# EAGLE design FlashPak (EAGLE 7.7.0)
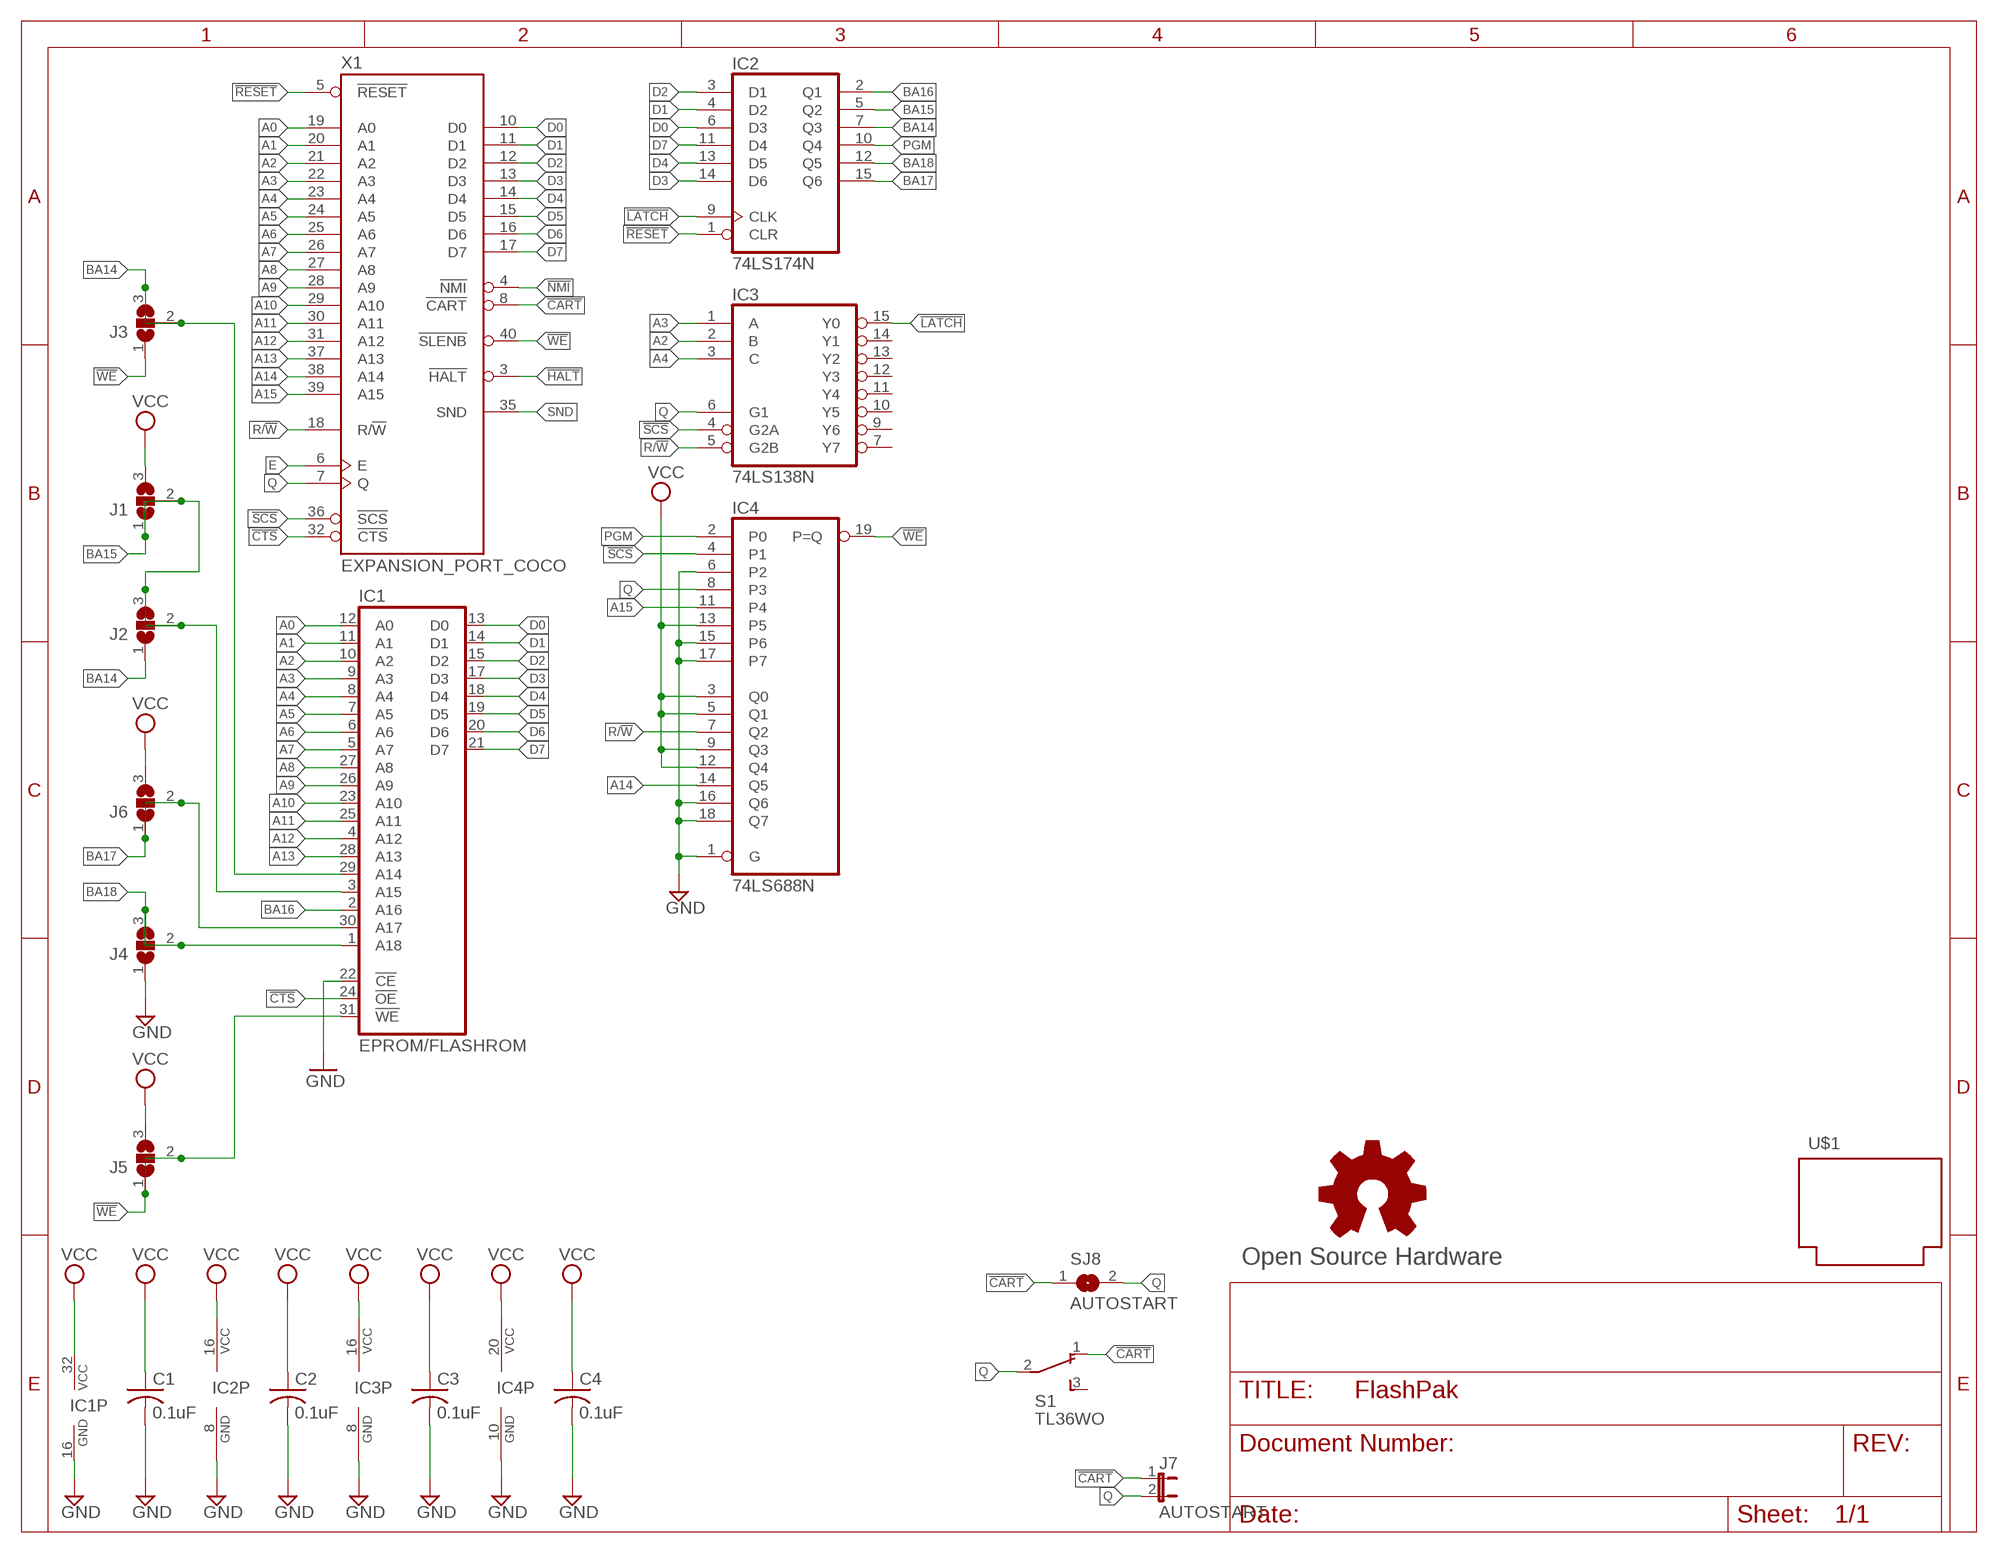
[diagram p0: schematic, sheet 1]

## Parts
C1  0.1uF  C-US025-025X050  [C025-025X050]
C2  0.1uF  C-US025-025X050  [C025-025X050]
C3  0.1uF  C-US025-025X050  [C025-025X050]
C4  0.1uF  C-US025-025X050  [C025-025X050]
GOLD_ORB_SM1  Open Source Hardware  OSHWLOGOLOGO8MM  [OSHW_8MM]
IC1  EPROM/FLASHROM  SST39SF040APHR  [DIL32-RP]
IC2  74LS174N  [DIL16-RP]
IC3  74LS138N  [DIL16-RP]
IC4  74LS688N  [DIL20-RP]
J1  SJ2W  [SJ_2]
J2  SJ2W  [SJ_2]
J3  SJ2W  [SJ_2]
J4  SJ2W  [SJ_2]
J5  SJ2W  [SJ_2]
J6  SJ2W  [SJ_2]
J7  AUTOSTART  JP1E  [JP1]
S1  TL36WO  [TL3XWO]
SJ8  AUTOSTART  SJ  [SJ]
U$1  PROGRAM_PAK  [PROGRAM_PAK]
X1  EXPANSION_PORT_COCO  [MA20-2]

## Nets
!CART: J7.1 S1.1(O) SJ8.1 X1.8(!CART)
!CTS: IC1.24(!OE) X1.32(!CTS)
!HALT: X1.3(!HALT)
!LATCH: IC2.9(CLK) IC3.15(Y0)
!NMI: X1.4(!NMI)
!RESET: IC2.1(CLR) X1.5(!RESET)
!SCS: IC3.4(G2A) IC4.4(P1) X1.36(!SCS)
!WE: IC1.31(!WE) IC4.19(P=Q) J3.1 J5.1 J5.2 X1.40(!SLENB)
A0: IC1.12(A0) X1.19(A0)
A1: IC1.11(A1) X1.20(A1)
A2: IC1.10(A2) IC3.2(B) X1.21(A2)
A3: IC1.9(A3) IC3.1(A) X1.22(A3)
A4: IC1.8(A4) IC3.3(C) X1.23(A4)
A5: IC1.7(A5) X1.24(A5)
A6: IC1.6(A6) X1.25(A6)
A7: IC1.5(A7) X1.26(A7)
A8: IC1.27(A8) X1.27(A8)
A9: IC1.26(A9) X1.28(A9)
A10: IC1.23(A10) X1.29(A10)
A11: IC1.25(A11) X1.30(A11)
A12: IC1.4(A12) X1.31(A12)
A13: IC1.28(A13) X1.37(A13)
A14: IC4.14(Q5) X1.38(A14)
A15: IC4.11(P4) X1.39(A15)
BA14: IC1.29(A14) IC2.7(Q3) J2.1 J3.2 J3.3
BA15: IC1.3(A15) IC2.5(Q2) J1.1 J1.2 J2.2 J2.3
BA16: IC1.2(A16) IC2.2(Q1)
BA17: IC1.30(A17) IC2.15(Q6) J6.1 J6.2
BA18: IC1.1(A18) IC2.12(Q5) J4.2 J4.3
D0: IC1.13(D0) IC2.6(D3) X1.10(D0)
D1: IC1.14(D1) IC2.4(D2) X1.11(D1)
D2: IC1.15(D2) IC2.3(D1) X1.12(D2)
D3: IC1.17(D3) IC2.14(D6) X1.13(D3)
D4: IC1.18(D4) IC2.13(D5) X1.14(D4)
D5: IC1.19(D5) X1.15(D5)
D6: IC1.20(D6) X1.16(D6)
D7: IC1.21(D7) IC2.11(D4) X1.17(D7)
E: X1.6(E)
GND: C1.2 C2.2 C3.2 C4.2 IC1.16(GND) IC1.22(!CE) IC2.8(GND) IC3.8(GND) IC4.1(G) IC4.6(P2) IC4.10(GND) IC4.15(P6) IC4.16(Q6) IC4.17(P7) IC4.18(Q7) J4.1
PGM: IC2.10(Q4) IC4.2(P0)
Q: IC3.6(G1) IC4.8(P3) J7.2 S1.2(P) SJ8.2 X1.7(Q)
R/!W: IC3.5(G2B) IC4.7(Q2) X1.18(R/!W)
SND: X1.35(SND)
VCC: C1.1 C2.1 C3.1 C4.1 IC1.32(VCC) IC2.16(VCC) IC3.16(VCC) IC4.3(Q0) IC4.5(Q1) IC4.9(Q3) IC4.12(Q4) IC4.13(P5) IC4.20(VCC) J1.3 J5.3 J6.3
Unconnected: IC3.7(Y7) IC3.9(Y6) IC3.10(Y5) IC3.11(Y4) IC3.12(Y3) IC3.13(Y2) IC3.14(Y1) S1.3(S)

## Power pins joined to a net without a drawn wire
+12V: X1.2(+12V)
-12V: X1.1(-12V)
GND: X1.33(GND) X1.34(GND)
VCC: X1.9(VCC)

## Library data of the parts
C1-C4 = rcl:C-US: CAPACITOR, American symbol
GOLD_ORB_SM1 = oshw:OSHWLOGO: The OSHW logo for PCB layout
IC1 = memory-sst:SST39SF040A: 4 Mbit x8 Multi-Purpose Flash Source: http://www.sst.com/dotAsset/40782.pdf
IC2 = 74xx-us-jlb:74*174: Hex D type FLIP FLOP, clear
IC3 = 74xx-us-jlb:74*138: 3-line to 8-line DECODER/DEMULTIPLEXER
IC4 = 74xx-us-jlb:74*688: 8-bit MAGNITUDE/IDENTITY COMPARATOR, totem pole
J1-J6 = jumper:SJ2W: SMD solder JUMPER
J7 = jumper:JP1E: JUMPER
S1 = switch:TL36WO: TINY SWITCH ON - ON Source: http://www2.produktinfo.conrad.com/datenblaetter/700000-724999/705152-da-01-de-Subminiaturschalter_TL_36WO.pdf
SJ8 = jumper-jlb:SJ: SMD solder JUMPER
U$1 = coco:PROGRAM_PAK
X1 = coco:EXPANSION_PORT_COCO

## Board
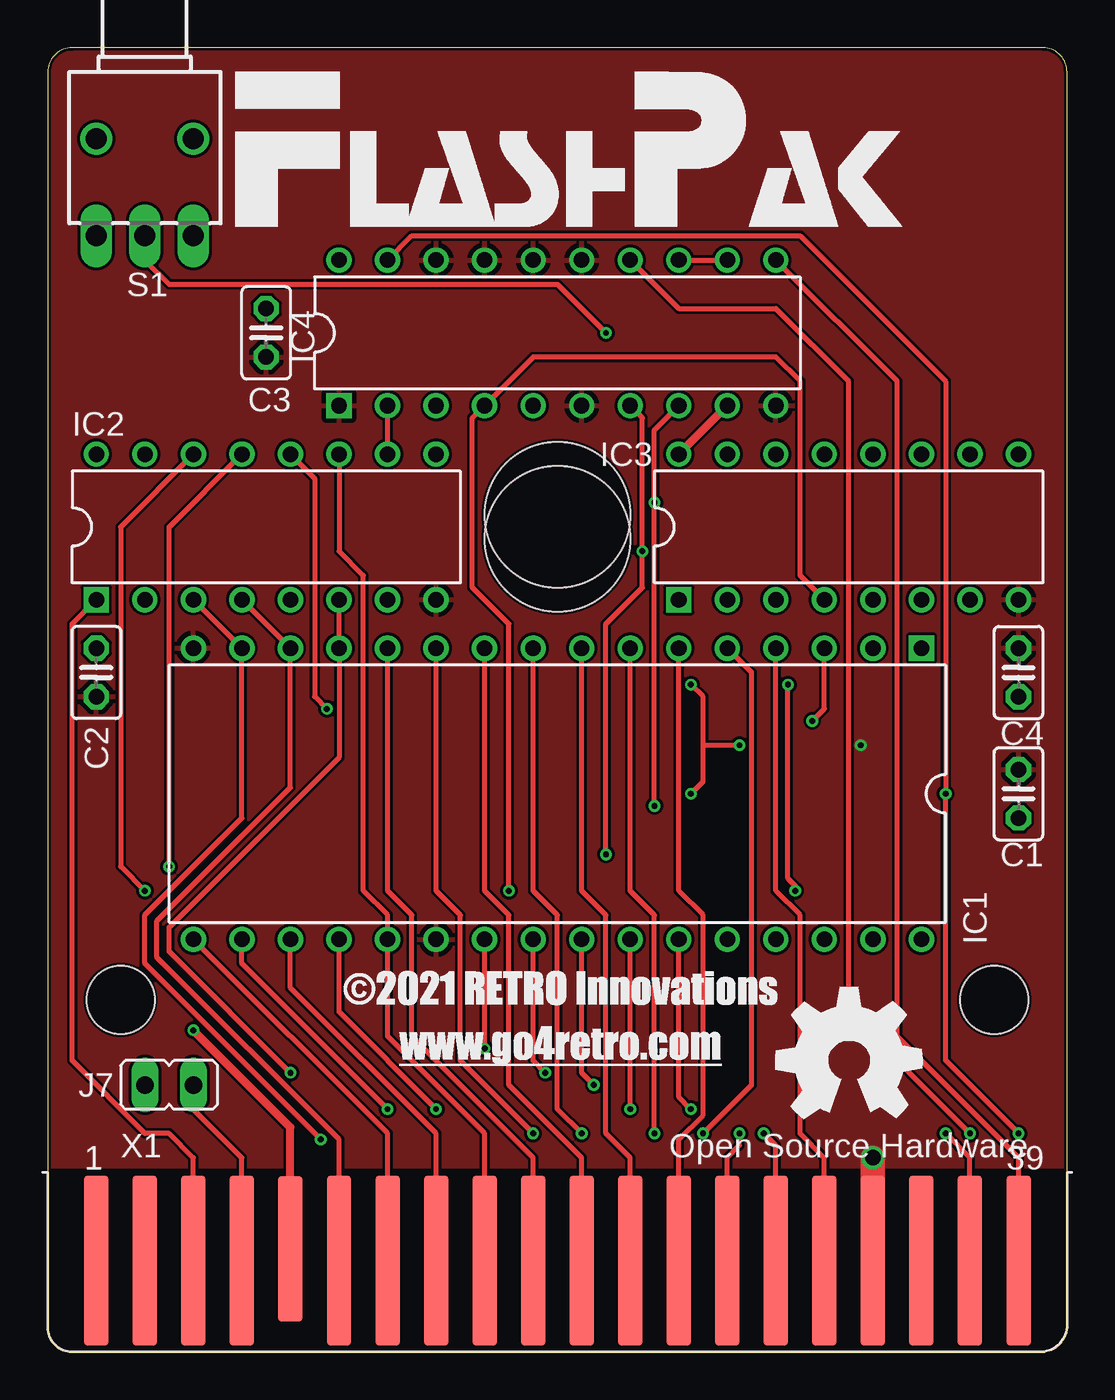
[diagram p1: board, top side]
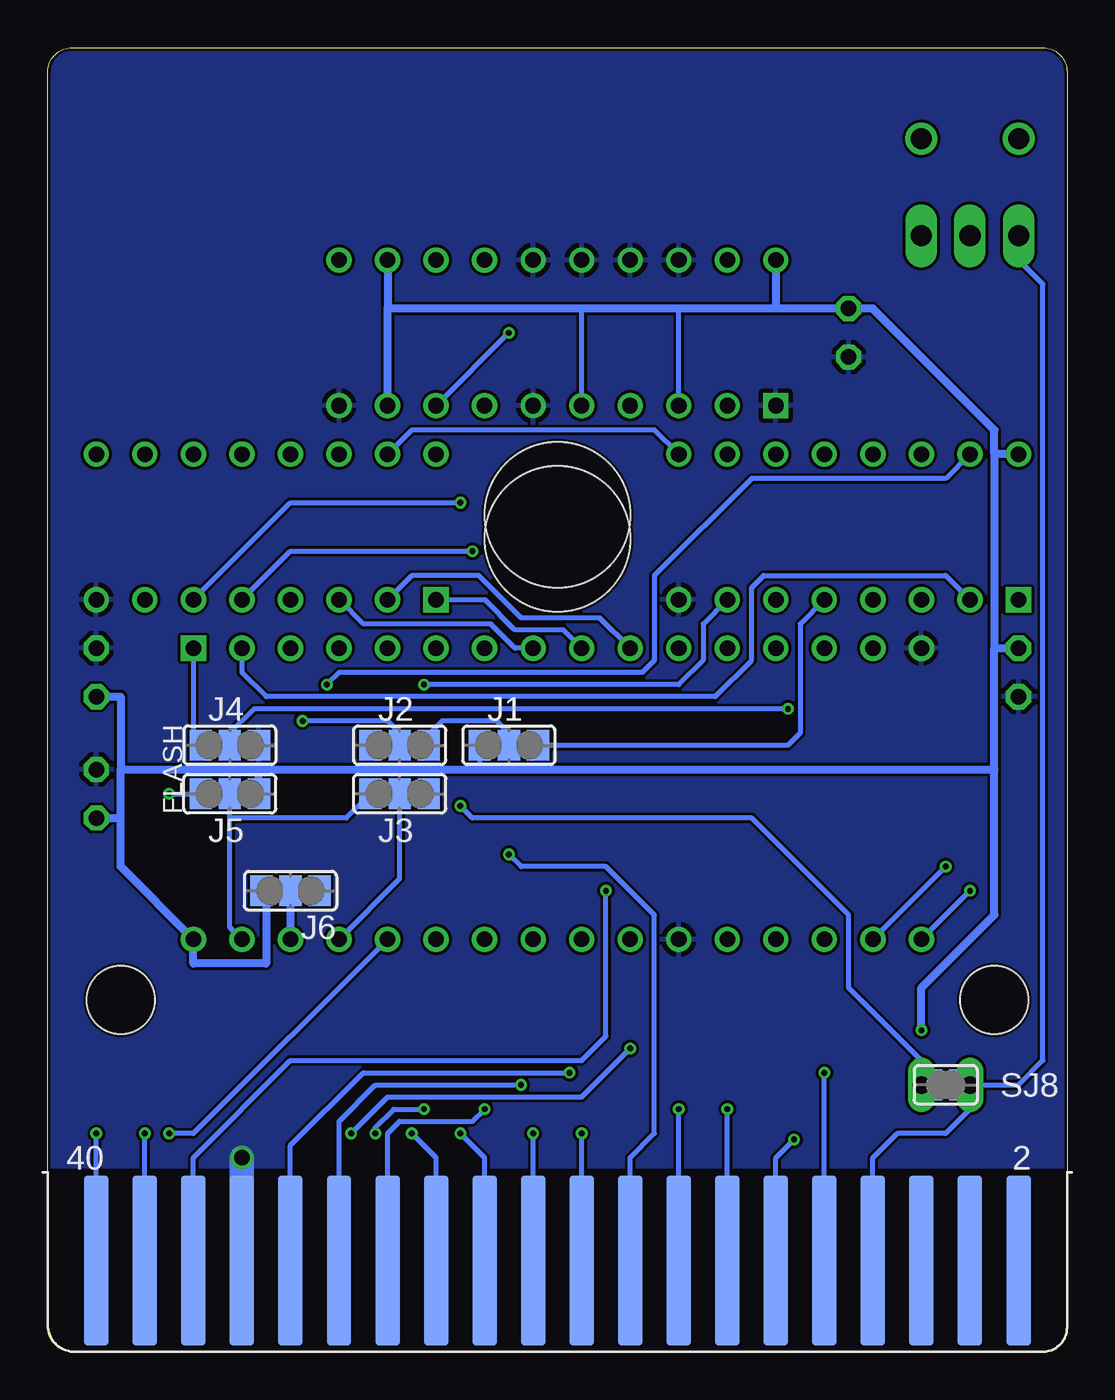
[diagram p2: board, bottom side, seen from below]

Size 53.34 x 68.26 mm. Coordinates in mm from the lower left corner, seen from the top.
Outline: 1.27,0 52.07,0 arc90 53.34,1.27 53.34,66.99 arc90 52.07,68.26 1.27,68.26 arc90 0,66.99 0,1.27 arc90 1.27,0
Copper layers (1*16): Top 0.035mm / dielectric 1.5mm / Bottom 0.035mm
Design rules "hackvana *": minimum track width 6mil, minimum drill 0.3mm, track to track 6mil, track to pad 6mil, pad to pad 6mil, via to via 6mil, smd to smd 0mil, copper to edge 6mil, drill to drill 6mil, minimum pad ring 10mil, minimum via ring 6mil, stop-mask expansion 2mil, vias tented up to drill 100mil, thermal gap 10mil

### Footprints (pad centres in the part's own frame; a part is rotated, then mirrored left to right if it is on the bottom)
C025-025X050 = drill 0.813 octagon: 1 -1.27,0; 2 1.27,0
DIL32-RP = drill 0.813 square: 1 -19.05,-7.62 | drill 0.813: 2 -16.51,-7.62; 3 -13.97,-7.62; 4 -11.43,-7.62; 5 -8.89,-7.62; 6 -6.35,-7.62; 7 -3.81,-7.62; 8 -1.27,-7.62; 9 1.27,-7.62; 10 3.81,-7.62; 11 6.35,-7.62; 12 8.89,-7.62; 13 11.43,-7.62; 14 13.97,-7.62; 15 16.51,-7.62; 16 19.05,-7.62; 17 19.05,7.62; 18 16.51,7.62; 19 13.97,7.62; 20 11.43,7.62; 21 8.89,7.62; 22 6.35,7.62; 23 3.81,7.62; 24 1.27,7.62; 25 -1.27,7.62; 26 -3.81,7.62; 27 -6.35,7.62; 28 -8.89,7.62; 29 -11.43,7.62; 30 -13.97,7.62; 31 -16.51,7.62; 32 -19.05,7.62
DIL16-RP = drill 0.813 square: 1 -8.89,-3.81 | drill 0.813: 2 -6.35,-3.81; 3 -3.81,-3.81; 4 -1.27,-3.81; 5 1.27,-3.81; 6 3.81,-3.81; 7 6.35,-3.81; 8 8.89,-3.81; 9 8.89,3.81; 10 6.35,3.81; 11 3.81,3.81; 12 1.27,3.81; 13 -1.27,3.81; 14 -3.81,3.81; 15 -6.35,3.81; 16 -8.89,3.81
DIL20-RP = drill 0.813 square: 1 -11.43,-3.81 | drill 0.813: 2 -8.89,-3.81; 3 -6.35,-3.81; 4 -3.81,-3.81; 5 -1.27,-3.81; 6 1.27,-3.81; 7 3.81,-3.81; 8 6.35,-3.81; 9 8.89,-3.81; 10 11.43,-3.81; 11 11.43,3.81; 12 8.89,3.81; 13 6.35,3.81; 14 3.81,3.81; 15 1.27,3.81; 16 -1.27,3.81; 17 -3.81,3.81; 18 -6.35,3.81; 19 -8.89,3.81; 20 -11.43,3.81
SJ_2 = smd 1.168 x 1.6: 1 -1.524,0; 2 0,0; 3 1.524,0
JP1 = drill 0.914 long: 1 0,-1.27; 2 0,1.27
TL3XWO = drill 1.1 pad 1.422 long: 1 -2.54,-5.08; 2 0,-5.08; 3 2.54,-5.08 | drill 1.1 pad 1.676: M1 -2.54,0; M2 2.54,0
SJ = smd 1.168 x 1.6: 1 -0.762,0; 2 0.762,0
PROGRAM_PAK = hole 7.62: 0,1.27; 0,0 | hole 3.556: -22.86,-24.13; 22.86,-24.13
MA20-2 = smd 1.27 x 8.89: 1 -24.13,-0.305; 3 -21.59,-0.305; 5 -19.05,-0.305; 7 -16.51,-0.305; 11 -11.43,-0.305; 13 -8.89,-0.305; 15 -6.35,-0.305; 17 -3.81,-0.305; 19 -1.27,-0.305; 21 1.27,-0.305; 23 3.81,-0.305; 25 6.35,-0.305; 27 8.89,-0.305; 29 11.43,-0.305; 31 13.97,-0.305; 33 16.51,-0.305; 35 19.05,-0.305; 37 21.59,-0.305; 39 24.13,-0.305 | smd 1.27 x 8.89 bottom: 2 -24.13,-0.305; 4 -21.59,-0.305; 6 -19.05,-0.305; 8 -16.51,-0.305; 10 -13.97,-0.305; 12 -11.43,-0.305; 14 -8.89,-0.305; 16 -6.35,-0.305; 18 -3.81,-0.305; 20 -1.27,-0.305; 22 1.27,-0.305; 24 3.81,-0.305; 26 6.35,-0.305; 28 8.89,-0.305; 30 11.43,-0.305; 32 13.97,-0.305; 34 16.51,-0.305; 36 19.05,-0.305; 38 21.59,-0.305; 40 24.13,-0.305 | smd 1.27 x 7.62: 9 -13.97,0.305

### Placement (x,y rotation side)
C1  50.8,29.21 90 top
C2  2.54,35.56 270 top
C3  11.43,53.34 270 top
C4  50.8,35.56 90 top
GOLD_ORB_SM1  41.91,15.24 0 top
IC1  26.67,29.21 180 top
IC2  11.43,43.18 0 top
IC3  41.91,43.18 0 top
IC4  26.67,53.34 0 top
J1  29.21,31.75 180 bottom
J2  34.93,31.75 0 bottom
J3  34.93,29.21 0 bottom
J4  43.81,31.75 180 bottom
J5  43.81,29.21 0 bottom
J6  40.64,24.13 180 bottom
J7  6.35,13.97 270 top
S1  5.08,63.5 0 top
SJ8  6.35,13.97 180 bottom
U$1  26.67,42.55 0 top
X1  26.67,5.08 0 top

### Tracks (layer width: path | path; a pad name or v marks a point on that pad's centre or on a via)
!CART
  Bottom 0.254: X1.8 10.16,10.16 8.89,11.43 6.35,11.43 5.08,12.7 J7.1 | J7.1 2.54,13.97 1.27,15.24 1.27,55.88 2.54,57.15 S1.1 | SJ8.1 J7.1
!CTS  (via drill 0.3)
  Top 0.254: v26.04,14.61 25.4,15.24 IC1.24
  Bottom 0.254: X1.32 40.64,10.79 36.83,14.61 v26.04,14.61
!LATCH
  Bottom 0.254: IC2.9 21.59,48.26 34.29,48.26 IC3.15
!RESET
  Top 0.254: X1.5 7.62,10.16 6.35,11.43 5.08,11.43 1.27,15.24 1.27,38.1 IC2.1
!SCS  (via drill 0.3)
  Top 0.254: v24.13,24.13 24.13,38.1 22.23,40.01 22.23,48.9 IC4.4 25.4,52.07 38.1,52.07 39.37,50.8 39.37,40.64 IC3.4
  Bottom 0.254: X1.36 45.72,10.16 40.64,15.24 25.4,15.24 24.13,16.51 v24.13,24.13
!WE  (via drill 0.3)
  Top 0.254: v50.8,11.43 46.99,15.24 v46.99,29.21 46.99,50.8 39.37,58.42 19.05,58.42 IC4.19
  Bottom 0.254: v46.99,29.21 J5.1 J5.2 43.81,27.94 | IC1.31 43.81,22.23 43.81,27.94 | J3.1 37.72,27.94 43.81,27.94 | X1.40 v50.8,11.43
A0
  Top 0.254: X1.19 25.4,10.16 19.05,16.51 19.05,22.86 17.78,24.13 IC1.12
A1  (via drill 0.3)
  Top 0.254: v25.4,11.43 21.59,15.24 21.59,22.86 20.32,24.13 IC1.11
  Bottom 0.254: X1.20 v25.4,11.43
A2
  Top 0.254: X1.21 27.94,10.16 24.13,13.97 24.13,22.86 22.86,24.13 IC1.10
  Bottom 0.254: IC1.10 24.45,38.42 28.58,38.42 30.8,40.64 34.29,40.64 IC3.2
A3  (via drill 0.3)
  Top 0.254: v27.94,11.43 26.67,12.7 26.67,22.86 25.4,24.13 IC1.9
  Bottom 0.254: X1.22 v27.94,11.43 | IC1.9 26.35,37.78 28.89,37.78 30.48,39.37 IC3.1
A4
  Top 0.254: X1.23 30.48,10.16 29.21,11.43 29.21,22.86 27.94,24.13 IC1.8
  Bottom 0.254: IC1.8 28.89,36.83 30.16,38.1 36.83,38.1 IC3.3
A5  (via drill 0.3)
  Top 0.254: v31.75,11.43 31.75,22.86 30.48,24.13 IC1.7
  Bottom 0.254: X1.24 30.48,10.16 v31.75,11.43
A6
  Top 0.254: X1.25 33.02,11.11 34.29,12.38 34.29,22.86 33.02,24.13 IC1.6
A7  (via drill 0.3)
  Top 0.254: v34.29,11.43 36.83,13.97 36.83,35.56 IC1.5
  Bottom 0.254: X1.26 33.02,10.16 v34.29,11.43
A8  (via drill 0.3)
  Top 0.254: X1.27 35.56,10.16 36.2,10.79 v36.2,11.43 | v33.66,12.7 33.02,13.34 IC1.27
  Bottom 0.254: v36.2,11.43 36.2,11.75 35.24,12.7 v33.66,12.7
A9  (via drill 0.3)
  Top 0.254: v30.48,12.7 IC1.26
  Bottom 0.254: X1.28 35.56,11.43 34.93,12.06 31.12,12.06 v30.48,12.7
A10  (via drill 0.3)
  Top 0.254: X1.29 38.1,10.79 v37.47,11.43 | v22.86,15.88 IC1.23
  Bottom 0.254: v37.47,11.43 35.56,13.34 25.4,13.34 v22.86,15.88
A11  (via drill 0.3)
  Top 0.254: v28.58,13.97 27.94,14.61 IC1.25
  Bottom 0.254: X1.30 38.1,12.06 36.2,13.97 v28.58,13.97
A12
  Top 0.254: X1.31 40.64,10.16 39.37,11.43 39.37,22.86 38.1,24.13 IC1.4
A13  (via drill 0.3)
  Top 0.254: X1.37 48.26,10.16 v46.99,11.43
  Bottom 0.254: IC1.28 45.72,11.43 v46.99,11.43
A14  (via drill 0.3)
  Top 0.254: v48.26,11.43 41.91,17.78 41.91,50.8 38.1,54.61 33.02,54.61 IC4.14
  Bottom 0.254: X1.38 v48.26,11.43
A15
  Top 0.254: X1.39 50.8,10.16 44.45,16.51 44.45,50.8 IC4.11
BA14  (via drill 0.3)
  Top 0.254: 34.29,31.75 34.29,29.84 v33.66,29.21 | 34.29,31.75 34.29,34.29 v33.66,34.92 | v36.2,31.75 34.29,31.75
  Bottom 0.254: IC2.7 19.05,38.1 19.05,36.2 20.32,34.92 v33.66,34.92 | J3.3 v33.66,29.21 J3.2 34.93,24.77 IC1.29 | J2.1 v36.2,31.75
BA15  (via drill 0.3)
  Top 0.254: v40.01,33.02 40.64,33.66 IC1.3
  Bottom 0.254: IC2.5 13.97,38.1 13.97,32.38 14.61,31.75 J1.1 J1.2 29.21,32.38 29.85,33.02 32.7,33.02 33.34,32.38 33.34,31.81 J2.3 J2.2 34.93,32.38 35.56,33.02 v40.01,33.02
BA16
  Bottom 0.254: IC1.2 43.18,35.56 41.91,34.29 18.41,34.29 16.51,36.2 16.51,40.01 15.88,40.64 6.35,40.64 IC2.2
BA17  (via drill 0.3)
  Top 0.254: v38.73,34.92 38.73,24.77 39.12,24.38 J6.1
  Bottom 0.254: IC2.15 6.35,45.72 16.51,45.72 21.59,40.64 21.59,36.2 22.23,35.56 38.1,35.56 v38.73,34.92 | J6.1 J6.2
  Bottom 0.406: J6.2 IC1.30
  other vias: 39.12,24.13
BA18  (via drill 0.3)
  Top 0.254: IC2.12 13.97,45.72 13.97,34.29 v14.61,33.66
  Bottom 0.254: v14.61,33.66 42.55,33.66 43.81,32.38 J4.2 J4.3 45.72,32.13 IC1.1
D0  (via drill 0.3)
  Top 0.254: v12.7,14.61 6.35,20.95 6.35,22.23 15.24,31.11 IC1.13 IC2.6
  Bottom 0.254: X1.10 v12.7,14.61
D1
  Top 0.254: X1.11 15.24,11.11 5.72,20.64 5.72,22.54 12.7,29.53 IC1.14 IC2.4
D2  (via drill 0.3)
  Top 0.254: v14.29,11.11 5.08,20.32 5.08,22.86 10.16,27.94 IC1.15 IC2.3
  Bottom 0.254: X1.12 15.24,10.16 v14.29,11.11
D3  (via drill 0.3)
  Top 0.254: X1.13 17.78,11.43 IC1.17 | IC2.14 3.81,43.18 3.81,25.4 v5.08,24.13
  Bottom 0.254: v5.08,24.13 IC1.17
D4  (via drill 0.3)
  Top 0.254: v17.78,12.7 10.16,20.32 IC1.18 | v6.35,25.4 6.35,43.18 IC2.13
  Bottom 0.254: X1.14 v17.78,12.7 | IC1.18 v6.35,25.4
D5
  Top 0.254: X1.15 20.32,11.43 12.7,19.05 IC1.19
D6  (via drill 0.3)
  Top 0.254: v20.32,12.7 15.24,17.78 IC1.20
  Bottom 0.254: X1.16 v20.32,12.7
D7
  Top 0.254: X1.17 22.86,11.43 17.78,16.51 IC1.21 17.78,22.86 16.51,24.13 16.51,40.64 15.24,41.91 IC2.11
GND  (via drill 0.3, 0.8)
  Top 1.27: v43.18,10.16 X1.34
  Bottom 1.27: X1.34 v43.18,10.16
  other vias: 42.55,31.75
  pour Bottom: 0,9.53 0,66.99 arc-90 1.27,68.26 52.07,68.26 arc-90 53.34,66.99 53.34,9.53
  pour Top (rank 2): 0,9.53 0,66.99 arc-90 1.27,68.26 52.07,68.26 arc-90 53.34,66.99 53.34,9.53
PGM
  Top 0.254: IC2.10 IC4.2
Q  (via drill 0.3)
  Top 0.254: X1.7 10.16,10.16 7.62,12.7 J7.2 | v31.75,28.57 v31.75,44.45 31.75,48.26 IC4.8 | S1.2 5.08,57.15 6.35,55.88 26.67,55.88 v29.21,53.34
  Bottom 0.254: v31.75,28.57 31.12,27.94 16.51,27.94 11.43,22.86 11.43,19.05 7.62,15.24 J7.2 SJ8.2 | IC3.6 40.64,44.45 v31.75,44.45 | v29.21,53.34 IC4.8
R/!W  (via drill 0.3)
  Top 0.254: v29.21,26.04 29.21,38.1 31.12,40.01 v31.12,41.91 31.12,48.9 IC4.7
  Bottom 0.254: X1.18 22.86,10.16 21.59,11.43 21.59,22.86 24.13,25.4 28.58,25.4 v29.21,26.04 | IC3.5 40.64,41.91 v31.12,41.91
VCC  (via drill 0.3)
  Top 0.254: IC4.13 IC4.12
  Top 0.406: X1.9 12.7,11.75 v7.62,16.83 | IC3.16 IC4.9
  Bottom 0.254: 40.89,30.48 41.28,30.48 | J1.3 30.73,30.48 30.48,30.48 | IC4.3 20.32,54.61 | IC4.5 25.4,54.61
  Bottom 0.406: v7.62,16.83 7.62,19.05 3.81,22.86 3.81,30.48 | 3.81,30.48 3.81,36.83 | 3.81,36.83 C2.1 | 3.81,46.99 3.81,36.83 | C4.1 49.53,34.29 49.53,30.48 | 49.53,27.94 49.53,25.4 IC1.32 45.72,20.32 41.91,20.32 41.91,24.26 42.29,24.26 J6.3 | 49.53,27.94 49.53,30.48 | 49.53,30.48 42.29,30.48 | 42.29,30.48 41.28,30.48 30.48,30.48 3.81,30.48 | C1.1 49.53,27.94 | J5.3 42.29,30.48 | IC2.16 3.81,46.99 | 15.24,54.61 C3.1 10.16,54.61 3.81,48.26 3.81,46.99 | 15.24,54.61 20.32,54.61 25.4,54.61 35.56,54.61 | IC4.20 15.24,54.61 | IC4.9 35.56,54.61 | IC4.12 35.56,54.61

### Text on the board
bNames: FLASH
bValues: FLASH28 | EPROM | 28-32